# Altium project LNA.PrjPcb
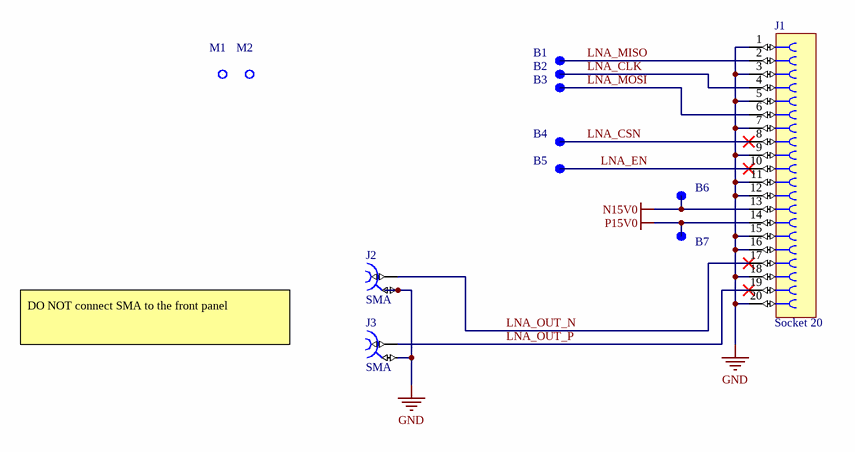
[diagram p0: LNA.SchDoc]
1 sheet, 12 parts. Net scope: global (net labels, ports and power ports of the same name join across sheets).
Board file: LNA.PcbDoc

## Sheet LNA.SchDoc: LNA Mezzanine
size A3; Author: M.Beldyga; CompanyName: WUT ISE; DrawnBy: M.Beldyga; Organization: WUT ISE; Address1: PW ISE; Address2: Nowowiejska 15/19 00-665 Warsaw; Address3: micbeldyga@gmail.com; SheetNumber: 1; SheetTotal: 1; ModifiedBy: -; CheckedDate: -; Title2: ADC 20b 40Msps; DivGrp: WUT ISE; Designer: M.Beldyga; ModifiedDate: -; ProjectName: Sensor Box

### Parts
B1  SMD Pad  [C100]  (value not drawn)
B2  SMD Pad  [C100]  (value not drawn)
B3  SMD Pad  [C100]  (value not drawn)
B4  SMD Pad  [C100]  (value not drawn)
B5  SMD Pad  [C100]  (value not drawn)
B6  SMD Pad  [C100]  (value not drawn)
B7  SMD Pad  [C100]  (value not drawn)
J1  Socket 20  [SAMTEC_SSW-110-01-G-D]
J2  SMA  [AMPHENOL_132203-12]
J3  SMA  [AMPHENOL_132203-12]
M1  Plated Hole  [MTG300_600]  (value not drawn)  (no BOM)
M2  Plated Hole  [MTG300_600]  (value not drawn)  (no BOM)

### Nets
GND: J1.1 J1.3 J1.5 J1.7 J1.9 J1.11 J1.12 J1.15 J1.16 J1.18 J1.20 J2.2 J3.2
N15V0: B6.1 J1.13
P15V0: B7.1 J1.14
LNA_CLK: B2.1 J1.4
LNA_CSN: B4.1 J1.8
LNA_EN: B5.1 J1.10
LNA_MISO: B1.1 J1.2
LNA_MOSI: B3.1 J1.6
LNA_OUT_N: J1.17 J2.1
LNA_OUT_P: J1.19 J3.1

Not connected (* = marked no-connect by the designer): M1 1; M2 1

### Notes on the sheet
- DO NOT connect SMA to the front panel
- Project/Equipment
- Document
- Designer
- Drawn by
- Check.by
- Contact
- File
- Last Mod.
- Print Date
- Sheet
- Size
- A3
- of
- Rev

### Library data of the parts
B1-B7 = SMD_PAD_D1MM: Pad; Part Description: 1mm Diameter SMD Pad; Mounted: No; Part Number: SMD_PAD_D1MM; Component Kind: Standard (No BOM); Component Type: Standard (No BOM); Pin Count: 1; Family: SMD Pad; Socket: No; SMD: Yes; Sense: No; Status: None; ComponentHeight: 0mm; HelpURL: Undefined; Author: CERN DEM JLC; CreateDate: 10/10/2017; LatestRevisionDate: 10/10/2017; PackageDescription: 1mm Diameter SMD Pad
J1 = SAMTEC_SSW-110-01-G-D: Connector 20 Female; Part Description: 20 Contacts, Pitch 2.54mm, Dual Row Through Mount Straight Socket (Lead Length 2.64mm); Manufacturer: SAMTEC; PressFit: No; Part Number: SAMTEC_SSW-110-01-G-D; Component Kind: Standard; Component Type: Standard; Pin Count: 20; Family: Socket 20; Mounted: Yes; Socket: No; SMD: No; Sense: No; Status: None; Manufacturer Part Number: SSW-110-01-G-D; ComponentHeight: 8.51mm; HelpURL: \\cern.ch\dfs\Applications\Altium\Datasheets\SAMTEC_SSW-110-01-G-D.pdf; Author: CERN DEM JLC; CreateDate: 7/19/2017; LatestRevisionDate: 7/19/2017
J2 J3 = 132203-12: RF Connector SMA Right Angle PCB Jack Through Hole 50 Ohm Bulkhead; Manufacturer: Amphenol Connex; Supplier: Mouser; Supplier Part Number: 523-132203-12; Manufacturer Part Number: 132203-12; RoHS: Yes; Category: RF / Coaxial Connectors; Stock: 515; Pricing: 1=20.22, 10=18.65, 50=18.65, 100=18.65, 1000=18.65, 10000=18.65 (USD); ComponentLink1URL: https://datasheet.ciiva.com/24241/132203-12-customer-drawing-24241088.pdf?src-supplier=Mouser; ComponentLink1Description: https://datasheet.ciiva.com/24241/132203-12-customer-drawing-24241088.pdf?src-supplier=Mouser; ComponentLink2URL: https://datasheet.ciiva.com/647/132203-12-647032.pdf?src-supplier=Digikey; ComponentLink2Description: https://datasheet.ciiva.com/647/132203-12-647032.pdf?src-supplier=Digikey
M1 M2 = PLATED_HOLE3.0_PAD6.0: Single Terminal Socket; Part Description: Plated Through Hole: Hole Dia.=3.0mm Pad Dia.=6.0mm; Mounted: No; Table: Pads; Part Number: PLATED_HOLE3.0_PAD6.0; Component Type: Standard (No BOM); Designator: Single Terminal Socket; Library Reference: Single Terminal Socket; Pin Count: 1; Family: Plated Hole; Socket: No; SMD: No; Status: None; ComponentHeight: 0mm; Author: CERN DEM JLC; CreateDate: 26.05.2008; LatestRevisionDate: 26.05.2008; PackageDescription: Plated Through Hole: Hole Dia.=3.0mm Pad Dia.=6.0mm